# EasyEDA schematic SCH_MiniCVGATE-ADSR.json
TITLE: CV KEYBOARD + ADSR; REV: 1.0; Date: 2023-04-24; Sheet: 1/1; Drawn By: Brian Hainsworth; Company: Your Company
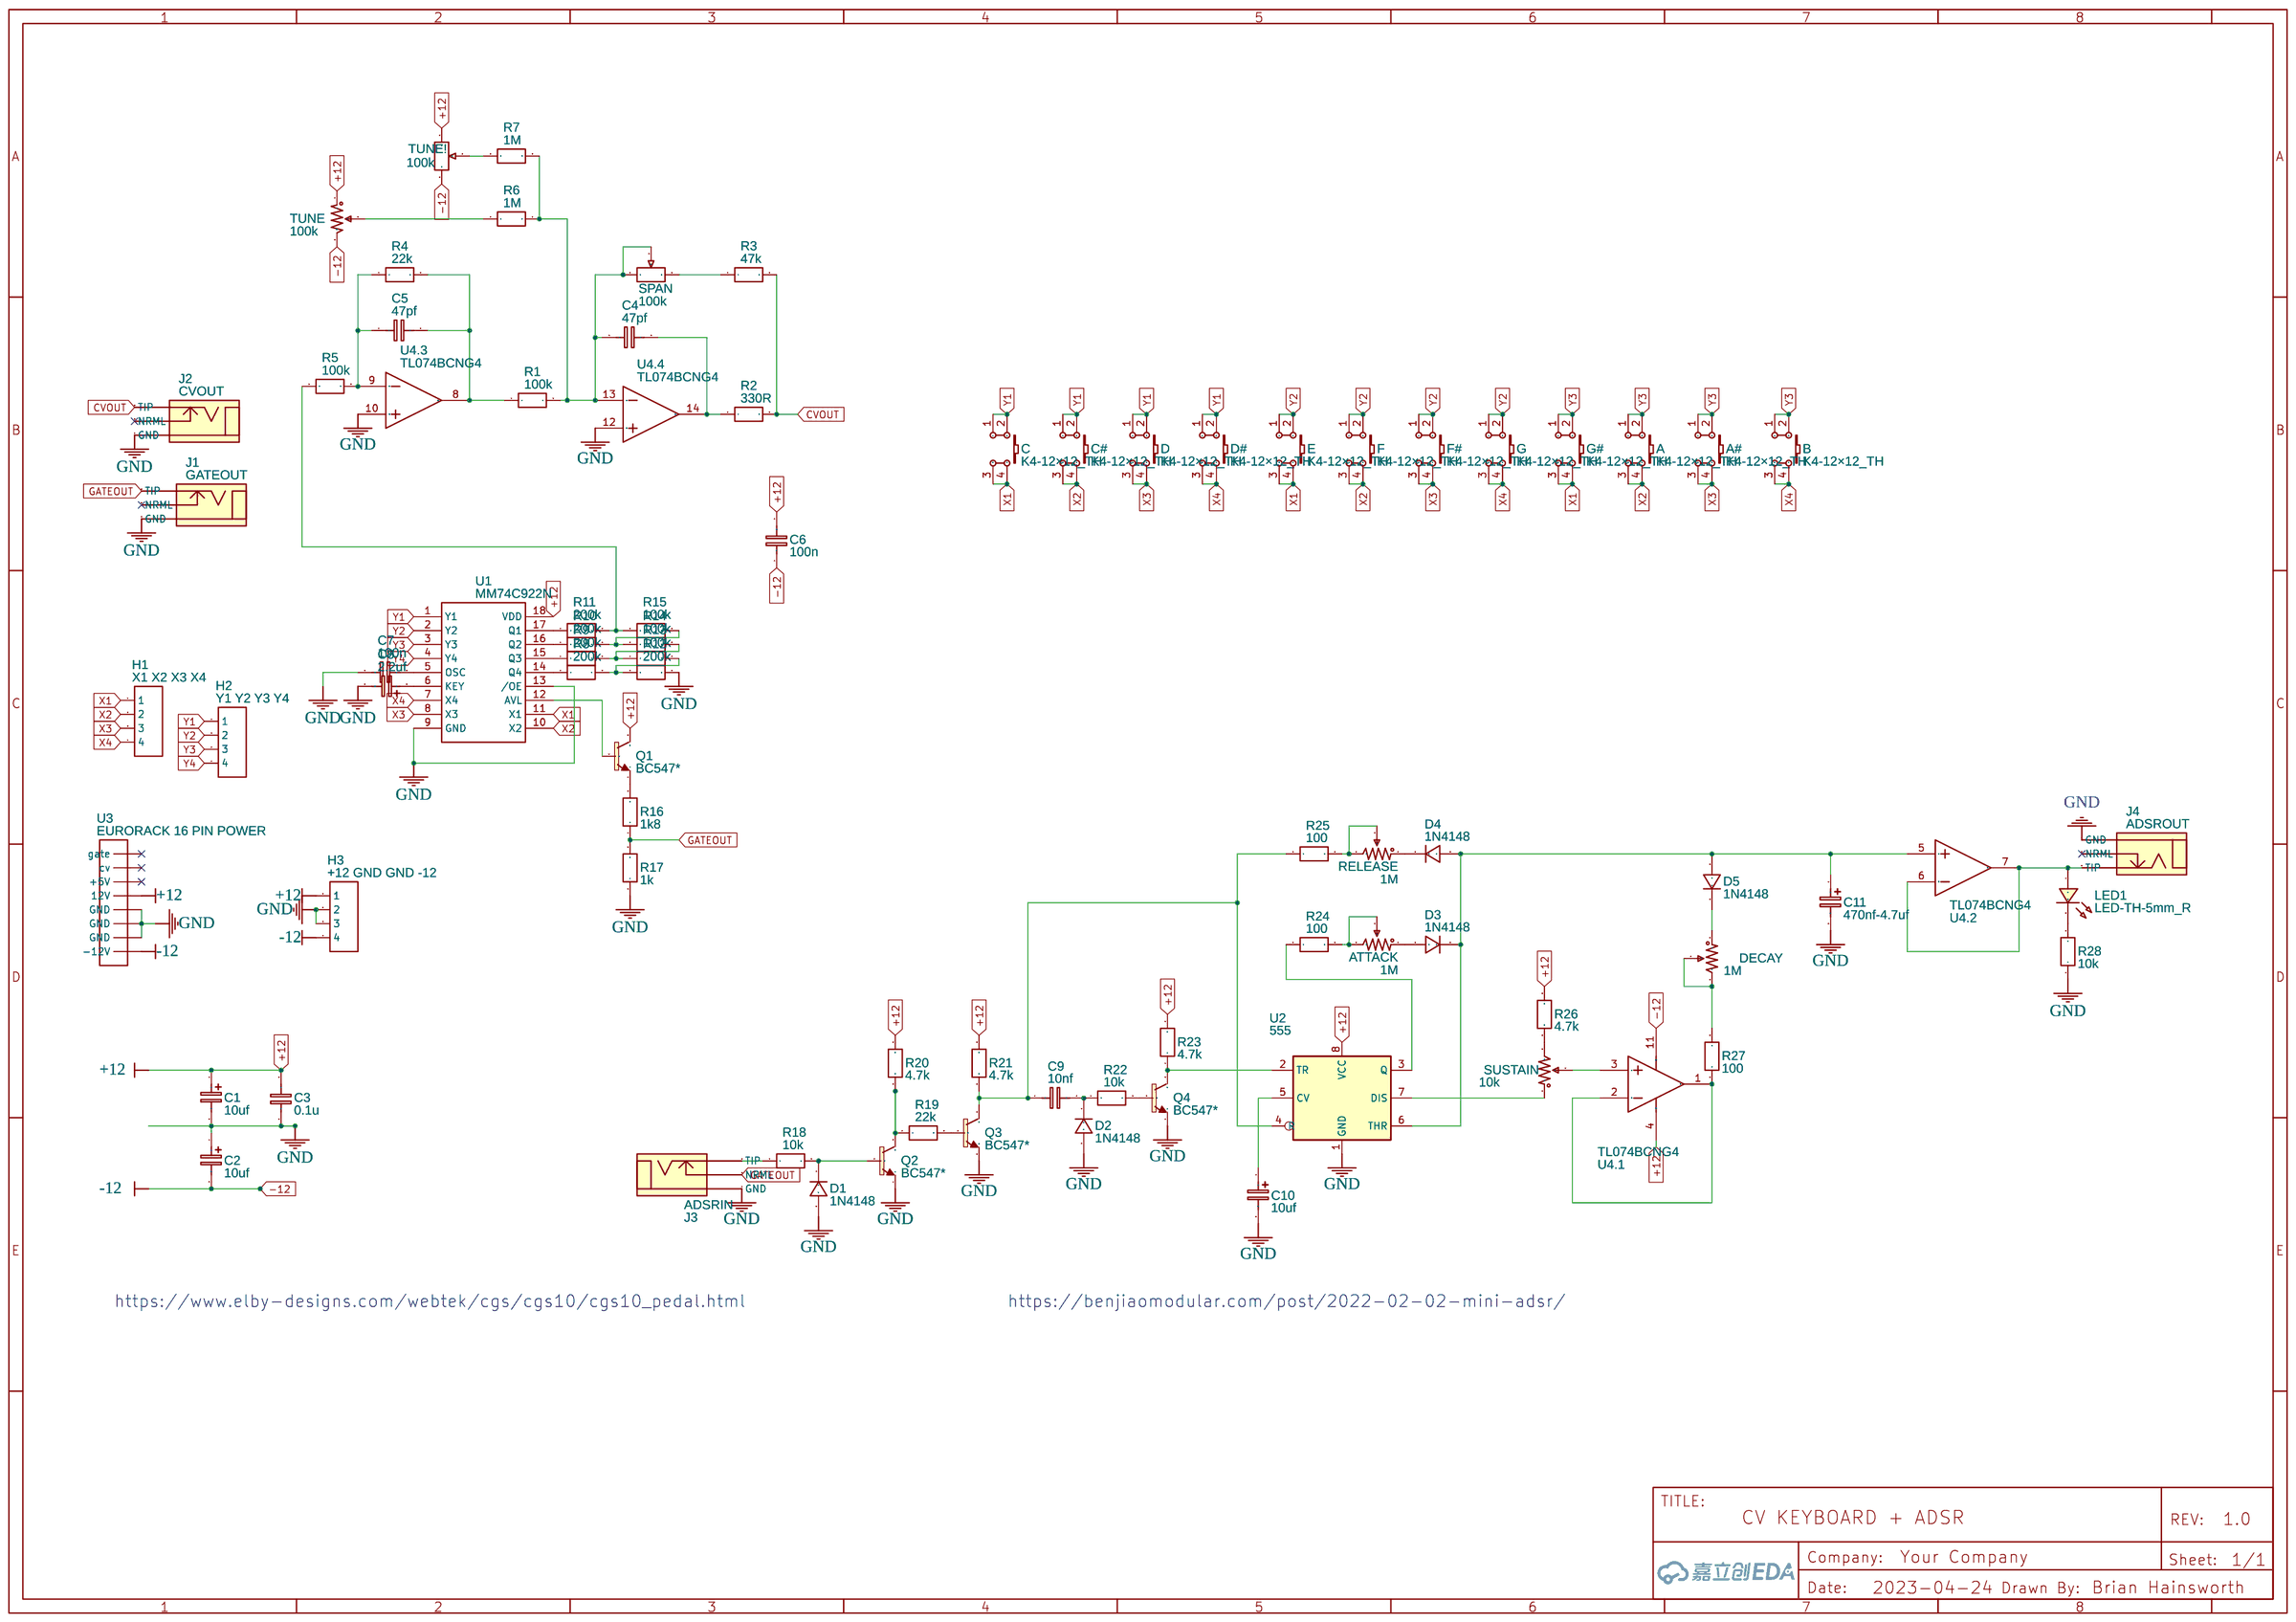
[diagram p0: schematic sheet]

## Parts
A  K4-12×12_TH  [KEY-TH_4P-L12.0-W12.0-P5.00-LS12.5]
A#  K4-12×12_TH  [KEY-TH_4P-L12.0-W12.0-P5.00-LS12.5]
ATTACK  1M  [ALPHA9MMPOT-NOOUTLINE]
B  K4-12×12_TH  [KEY-TH_4P-L12.0-W12.0-P5.00-LS12.5]
C  K4-12×12_TH  [KEY-TH_4P-L12.0-W12.0-P5.00-LS12.5]
C1  10uf  [CAP-D5.0×F2.0]
C2  10uf  [CAP-D5.0×F2.0]
C3  0.1u  [RAD-0.2]
C4  47pf  [RAD-0.2]
C5  47pf  [RAD-0.2]
C6  100n  [RAD-0.2]
C7  100n  [RAD-0.2]
C8  2.2uf  [CAP-D5.0×F2.0]
C9  10nf  [RAD-0.2]
C10  10uf  [CAP-D5.0×F2.0]
C11  470nf-4.7uf  [CAP-D5.0×F2.0]
C#  K4-12×12_TH  [KEY-TH_4P-L12.0-W12.0-P5.00-LS12.5]
D  K4-12×12_TH  [KEY-TH_4P-L12.0-W12.0-P5.00-LS12.5]
D1  1N4148  [DO-35_BD2.0-L4.2-P8.20-D0.5-RD]
D2  1N4148  [DO-35_BD2.0-L4.2-P8.20-D0.5-RD]
D3  1N4148  [DO-35_BD2.0-L4.2-P8.20-D0.5-RD]
D4  1N4148  [DO-35_BD2.0-L4.2-P8.20-D0.5-RD]
D5  1N4148  [DO-35_BD2.0-L4.2-P8.20-D0.5-RD]
D#  K4-12×12_TH  [KEY-TH_4P-L12.0-W12.0-P5.00-LS12.5]
DECAY  1M  [ALPHA9MMPOT-NOOUTLINE]
E  K4-12×12_TH  [KEY-TH_4P-L12.0-W12.0-P5.00-LS12.5]
F  K4-12×12_TH  [KEY-TH_4P-L12.0-W12.0-P5.00-LS12.5]
F#  K4-12×12_TH  [KEY-TH_4P-L12.0-W12.0-P5.00-LS12.5]
G  K4-12×12_TH  [KEY-TH_4P-L12.0-W12.0-P5.00-LS12.5]
G#  K4-12×12_TH  [KEY-TH_4P-L12.0-W12.0-P5.00-LS12.5]
H1  X1 X2 X3 X4  [HDR-F-2.54_1X4]
H2  Y1 Y2 Y3 Y4  [HDR-F-2.54_1X4]
H3  +12 GND GND -12  [HDR-F-2.54_1X4]
J1  GATEOUT  [PJ-3001F]
J2  CVOUT  [PJ-3001F]
J3  ADSRIN  [PJ-3001F]
J4  ADSROUT  [PJ-3001F]
LED1  LED-TH-5mm_R  [LED-TH_BD5.0_RED]
Q1  BC547*  [TO92]
Q2  BC547*  [TO92]
Q3  BC547*  [TO92]
Q4  BC547*  [TO92]
R1  100k  [R_AXIAL-0.4]
R2  330R  [R_AXIAL-0.4]
R3  47k  [R_AXIAL-0.4]
R4  22k  [R_AXIAL-0.4]
R5  100k  [R_AXIAL-0.4]
R6  1M  [R_AXIAL-0.4]
R7  1M  [R_AXIAL-0.4]
R8  200k  [R_AXIAL-0.4]
R9  200k  [R_AXIAL-0.4]
R10  200k  [R_AXIAL-0.4]
R11  200k  [R_AXIAL-0.4]
R12  200k  [R_AXIAL-0.4]
R13  100k  [R_AXIAL-0.4]
R14  100k  [R_AXIAL-0.4]
R15  100k  [R_AXIAL-0.4]
R16  1k8  [R_AXIAL-0.4]
R17  1k  [R_AXIAL-0.4]
R18  10k  [R_AXIAL-0.4]
R19  22k  [R_AXIAL-0.4]
R20  4.7k  [R_AXIAL-0.4]
R21  4.7k  [R_AXIAL-0.4]
R22  10k  [R_AXIAL-0.4]
R23  4.7k  [R_AXIAL-0.4]
R24  100  [R_AXIAL-0.4]
R25  100  [R_AXIAL-0.4]
R26  4.7k  [R_AXIAL-0.4]
R27  100  [R_AXIAL-0.4]
R28  10k  [R_AXIAL-0.4]
RELEASE  1M  [ALPHA9MMPOT-NOOUTLINE]
SPAN  100k  [RES-ADJ-TH_3296W]
SUSTAIN  10k  [ALPHA9MMPOT-NOOUTLINE]
TUNE  100k  [ALPHA9MMPOT-NOOUTLINE]
TUNE!  100k  [RES-ADJ-TH_3296W]
U1  MM74C922N  [DIP-18]
U2  555  [DIP-8_W7.62MM]
U3  EURORACK 16 PIN POWER  [EURORACK SHROUDED POWER 16 PIN]
U4  TL074BCNG4  [PDIP-14_L19.3-W6.4-P2.54-LS7.9-BL-1]  (sections 1,2,3,4)

## Library data of the parts
A A# B C C# D D# E F F# G G# = K4-12×12_TH: Supplier Part: C128053; Supplier: LCSC; Manufacturer: 韩国韩荣; Manufacturer Part: K2-1103DP-M4SW-04; Contributor: LCEDA_Lib
ATTACK DECAY RELEASE = R_3386P_US: Supplier: LCSC; Contributor: LCEDA_Lib
C1 C2 C8 C10 C11 = CE_TH_D5.0×F2.0_EU: Contributor: LCEDA_Lib
C3-C7 C9 = C_RAD-0.2_EU: Contributor: LCEDA_Lib
D1-D5 = 1N4148: Supplier: LCSC; Supplier Part: C13769; Manufacturer: STMicroelectronics; Contributor: LCSC
H1-H3 = HDR-F-2.54_1x4: Supplier Part: C225501; Supplier: LCSC; Contributor: LCEDA_Lib
J1-J4 = PJ-3001F BLENDED GRND PIN: Manufacturer: Tayda Electronics; Supplier: Tayda Electronics; link: https://www.taydaelectronics.com/pj-3001f-3-5-mm-mono-phone-jack.html; Contributor: asciiface
LED1 = LED-TH-5mm_R: Manufacturer: EVERLIGHT(台湾亿光); Manufacturer Part: 333-2SURD/S530-A3; Supplier Part: C87271; Supplier: LCSC; Contributor: LCEDA_Lib
Q1-Q4 = BC547*: Contributor: Brian Hainsworth
R1-R28 = R_AXIAL-0.4_EU: Contributor: LCEDA_Lib
SPAN TUNE! = R_3296W_EU: Supplier: LCSC; Contributor: LCEDA_Lib; Value(Ω): 10k
SUSTAIN TUNE = R_3386P_US: Supplier: LCSC; Contributor: LCEDA_Lib; value(Ω): 1M
U1 = MM74C922N: Contributor: Bam Bam
U2 = LMC555xN: Contributor: Brian Hainsworth
U3 = EURORACK 16 PIN POWER: Manufacturer Part: New SchematicLib; Contributor: eduard.frentescu
U4 = TL074BCNG4: Supplier: LCSC; Supplier Part: C1348503; Manufacturer: TI(德州仪器); link: https://atta.szlcsc.comnull; subpart_no: 1

## Nets
GND: C1.2 C2.1 C3.1 C7.1 C8.2 C10.2 C11.2 D1.2 D2.2 H3.2 H3.3 J1.1(GND) J2.1(GND) J3.1(GND) J4.1(GND) Q2.1(E) Q3.1(E) Q4.1(E) R12.2 R17.1 R28.1 U1.9(GND) U1.13(/OE) U2.1(GND) U3.2(GND) U3.3(GND) U3.4(GND) U4.10(3IN+) U4.12(4IN+)
+12: C1.1 C3.2 C6.2 H3.1 Q1.3(C) R20.2 R21.2 R23.2 R26.2 TUNE.1 TUNE!.1 U1.18(VDD) U2.8(VCC) U3.5(12V) U4.4(VCC+)
-12: C2.2 C6.1 H3.4 TUNE.3 TUNE!.3 U3.1(-12V) U4.11(VCC-)
CVOUT: J2.3(TIP) R2.2 R3.2
GATEOUT: J1.3(TIP) J3.2(NRML) R16.1 R17.2
X1: C.3 C.4 E.3 E.4 G#.3 G#.4 H1.1 U1.11(X1)
X2: A.3 A.4 C#.3 C#.4 F.3 F.4 H1.2 U1.10(X2)
X3: A#.3 A#.4 D.3 D.4 F#.3 F#.4 H1.3 U1.8(X3)
X4: B.3 B.4 D#.3 D#.4 G.3 G.4 H1.4 U1.7(X4)
Y1: C.1 C.2 C#.1 C#.2 D.1 D.2 D#.1 D#.2 H2.1 U1.1(Y1)
Y2: E.1 E.2 F.1 F.2 F#.1 F#.2 G.1 G.2 H2.2 U1.2(Y2)
Y3: A.1 A.2 A#.1 A#.2 B.1 B.2 G#.1 G#.2 H2.3 U1.3(Y3)
Y4: H2.4 U1.4(Y4)
Net-(ATTACK-1): ATTACK.1 D3.2
Net-(ATTACK-2): ATTACK.2 ATTACK.3 R24.2
Net-(C4-1): C4.1 R1.2 R6.2 R7.2 SPAN.1 SPAN.2 U4.13(4IN-)
Net-(C4-2): C4.2 R2.1 U4.14(4OUT)
Net-(C5-1): C5.1 R4.1 R5.2 U4.9(3IN-)
Net-(C5-2): C5.2 R1.1 R4.2 U4.8(3OUT)
Net-(C7-2): C7.2 U1.5(OSC)
Net-(C8-1): C8.1 U1.6(KEY)
Net-(C9-1): C9.1 Q3.3(C) R21.1 R25.1 U2.4(R)
Net-(C9-2): C9.2 D2.1 R22.1
Net-(C10-1): C10.1 U2.5(CV)
Net-(C11-1): C11.1 D3.1 D4.2 D5.2 U2.6(THR) U4.5(2IN+)
Net-(D1-1): D1.1 Q2.2(B) R18.2
Net-(D4-1): D4.1 RELEASE.1
Net-(D5-1): D5.1 DECAY.1
Net-(DECAY-2): DECAY.2 DECAY.3 R27.2
Net-(J3-3): J3.3(TIP) R18.1
Net-(J4-3): J4.3(TIP) LED1.1 U4.6(2IN-) U4.7(2OUT)
Net-(LED1-2): LED1.2 R28.2
Net-(Q1-1): Q1.1(E) R16.2
Net-(Q1-2): Q1.2(B) U1.12(AVL)
Net-(Q2-3): Q2.3(C) R19.1 R20.1
Net-(Q3-2): Q3.2(B) R19.2
Net-(Q4-2): Q4.2(B) R22.2
Net-(Q4-3): Q4.3(C) R23.1 U2.2(TR)
Net-(R3-1): R3.1 SPAN.3
Net-(R5-1): R5.1 R11.2 R15.1
Net-(R6-1): R6.1 TUNE.2
Net-(R7-1): R7.1 TUNE!.2
Net-(R8-1): R8.1 U1.14(Q4)
Net-(R8-2): R8.2 R12.1 R13.2
Net-(R9-1): R9.1 U1.15(Q3)
Net-(R9-2): R9.2 R13.1 R14.2
Net-(R10-1): R10.1 U1.16(Q2)
Net-(R10-2): R10.2 R14.1 R15.2
Net-(R11-1): R11.1 U1.17(Q1)
Net-(R24-1): R24.1 U2.3(Q)
Net-(R25-2): R25.2 RELEASE.2 RELEASE.3
Net-(R26-1): R26.1 SUSTAIN.3
Net-(R27-1): R27.1 U4.1(1OUT) U4.2(1IN-)
Net-(SUSTAIN-1): SUSTAIN.1 U2.7(DIS)
Net-(SUSTAIN-2): SUSTAIN.2 U4.3(1IN+)

Not connected (* = marked no-connect by the designer): J1 2(NRML)*; J2 2(NRML)*; J4 2(NRML)*; U3 6(+5V)* 7(cv)* 8(gate)*

## Notes on the sheet
- https://www.elby-designs.com/webtek/cgs/cgs10/cgs10_pedal.html
- https://benjiaomodular.com/post/2022-02-02-mini-adsr/
